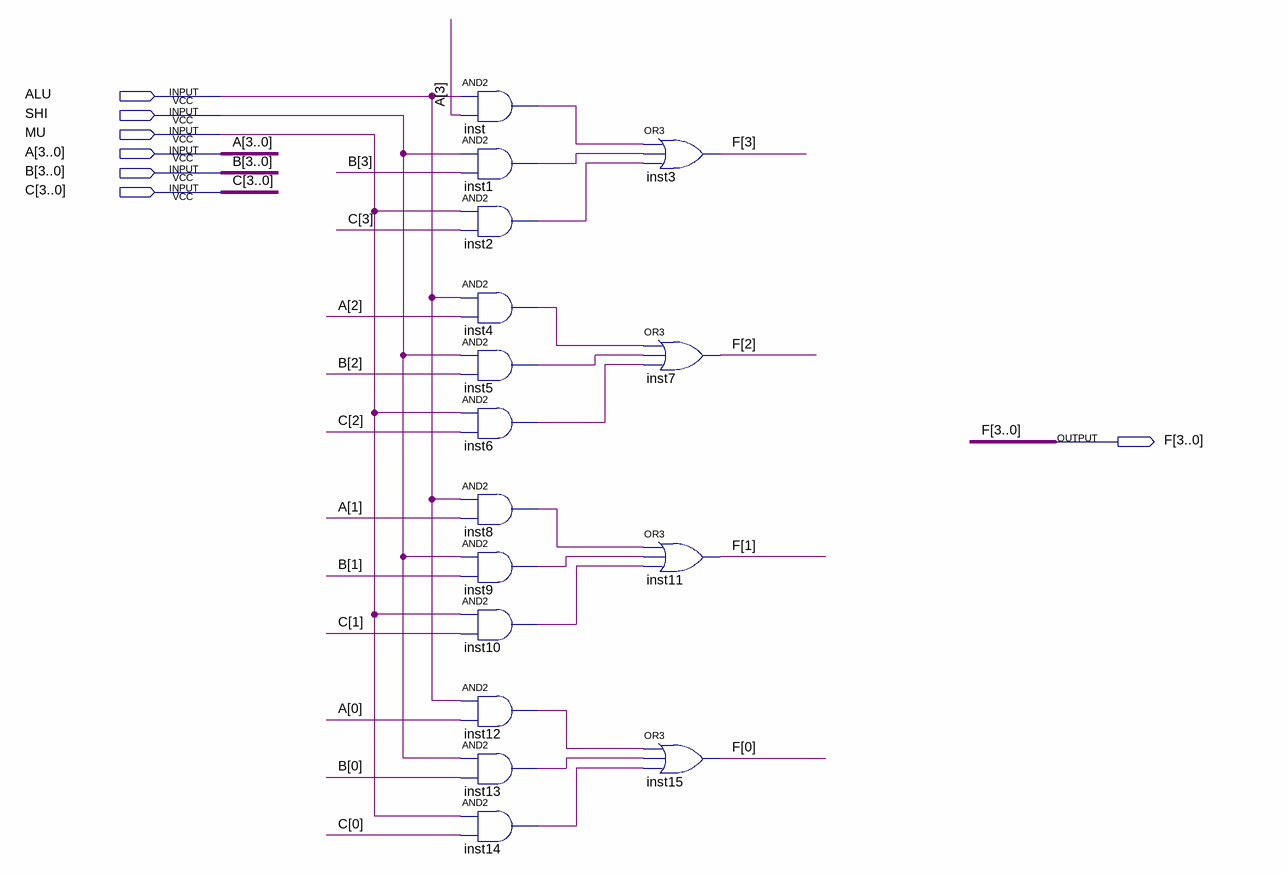
[diagram p0: schematic sheet]
// Quartus schematic Three_One.bdf as structural Verilog: 16 symbols, 7 pins
module Three_One (
  input  ALU,
  input  SHI,
  input  MU,
  input  [3:0] A,
  input  [3:0] B,
  input  [3:0] C,
  output [3:0] F
);

  wire inst1_out, inst2_out, inst4_out, inst5_out, inst6_out, inst8_out, inst9_out, inst10_out, inst12_out,
       inst13_out, inst14_out, inst_out;

  and inst (inst_out, ALU, A[3]);
  and inst1 (inst1_out, SHI, B[3]);
  and inst2 (inst2_out, MU, C[3]);
  and inst4 (inst4_out, ALU, A[2]);
  and inst5 (inst5_out, SHI, B[2]);
  and inst6 (inst6_out, MU, C[2]);
  and inst8 (inst8_out, ALU, A[1]);
  and inst9 (inst9_out, SHI, B[1]);
  and inst10 (inst10_out, MU, C[1]);
  and inst12 (inst12_out, ALU, A[0]);
  and inst13 (inst13_out, SHI, B[0]);
  and inst14 (inst14_out, MU, C[0]);
  or inst3 (F[3], inst_out, inst1_out, inst2_out);
  or inst7 (F[2], inst4_out, inst5_out, inst6_out);
  or inst11 (F[1], inst8_out, inst9_out, inst10_out);
  or inst15 (F[0], inst12_out, inst13_out, inst14_out);
endmodule
